# EAGLE schematic Arduino car (EAGLE 9.6.2)
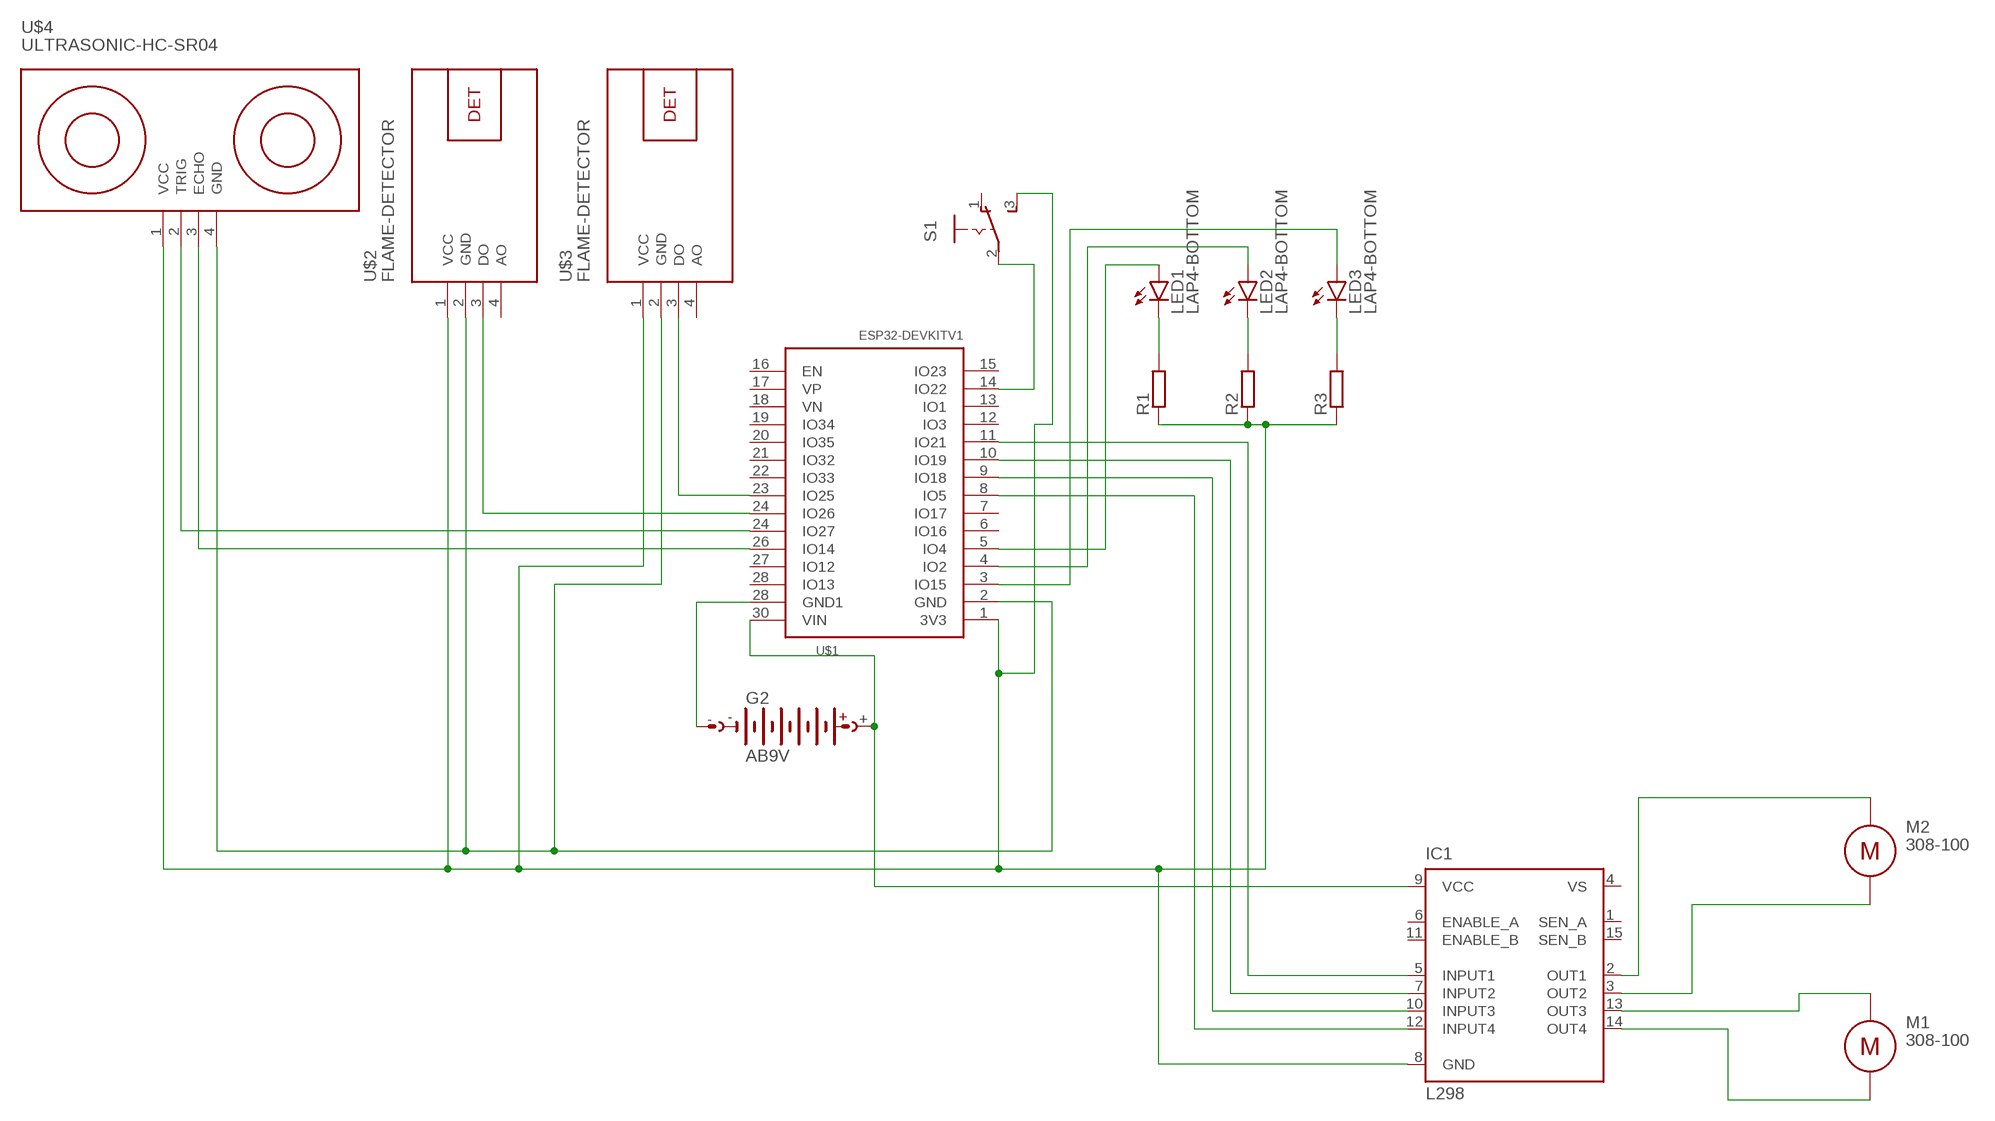
[diagram p0: schematic, sheet 1]

## Parts
G2  AB9V  [AB9V]
IC1  L298  [MULTIWATT-15]
LED1  LAP4-BOTTOM  [P47F-BOTTOM]
LED2  LAP4-BOTTOM  [P47F-BOTTOM]
LED3  LAP4-BOTTOM  [P47F-BOTTOM]
M1  308-100  [308-100]
M2  308-100  [308-100]
R1  BVS  [BVS]
R2  BVS  [BVS]
R3  BVS  [BVS]
S1  255SB  [255SB]
U$1  ESP32DEVKITV1  [ESP32-DEVKITV1]
U$2  FLAME-DETECTOR  [FLAME-DETECTOR]
U$3  FLAME-DETECTOR  [FLAME-DETECTOR]
U$4  ULTRASONIC-HC-SR04  [ULTRASONIC-HC-SR04]

## Nets
N$1: G2.+ IC1.9(VCC) U$1.30(VIN)
N$2: G2.- U$1.28(GND1)
N$3: IC1.8(GND) R1.2 R2.2 R3.2 S1.3(S) U$1.1(3V3) U$2.1(VCC) U$3.1(VCC) U$4.1(VCC)
N$4: U$1.2(GND) U$2.2(GND) U$3.2(GND) U$4.4(GND)
N$5: U$1.24(IO27) U$4.2(TRIG)
N$6: U$1.26(IO14) U$4.3(ECHO)
N$7: LED1.C R1.1
N$8: LED2.C R2.1
N$9: LED3.C R3.1
N$10: IC1.2(OUT1) M2.POS
N$11: IC1.3(OUT2) M2.NEG
N$12: IC1.13(OUT3) M1.POS
N$13: IC1.14(OUT4) M1.NEG
N$14: IC1.5(INPUT1) U$1.11(IO21)
N$15: U$1.24(IO26) U$2.3(DO)
N$16: U$1.23(IO25) U$3.3(DO)
N$17: IC1.7(INPUT2) U$1.10(IO19)
N$18: IC1.10(INPUT3) U$1.9(IO18)
N$19: IC1.12(INPUT4) U$1.8(IO5)
N$20: LED1.A U$1.5(IO4)
N$21: LED2.A U$1.4(IO2)
N$22: LED3.A U$1.3(IO15)
N$23: S1.2(P) U$1.14(IO22)
Unconnected: IC1.1(SEN_A) IC1.6(ENABLE_A) IC1.11(ENABLE_B) IC1.15(SEN_B) S1.1(O) U$1.6(IO16) U$1.7(IO17) U$1.12(IO3) U$1.13(IO1) U$1.15(IO23) U$1.16(EN) U$1.17(VP) U$1.18(VN) U$1.19(IO34) U$1.20(IO35) U$1.21(IO32) U$1.22(IO33) U$1.27(IO12) U$1.28(IO13) U$2.4(AO) U$3.4(AO)

## Power pins joined to a net without a drawn wire
VS: IC1.4(VS)

## Library data of the parts
G2 = battery:AB9V: 9-V BATTERY CLIP
IC1 = st-microelectronics-2:L298: DUAL FULL-BRIDGE DRIVER
LED1-LED3 = led:*P4: PointLED® Enhanced Thinfilm LED TOP & BOTTOM mount LS P47F, LR P47F, LA P47F, LY P47F, LT P4SG, LB P4SG, LW P4SG Source: http://catalog.osram-os.com .. LA_LR_LS_LY_P47F_Pb_free.pdf
M1 M2 = motor:308-100: Pico Vibe 8mm Vibration Motor - 3mm Type; PRECISION_MICRODRIVES: 308-100
R1-R3 = resistor-shunt:BVS: SMD SHUNT RESISTOR; OC_FARNELL: unknown; OC_NEWARK: unknown
S1 = switch:255SB: SLIDING SWITCH Distributor Buerklin, 11G810
U$1 = ESP32-DEVKITV1:ESP32DEVKITV1
U$2 U$3 = diy-modules:FLAME-DETECTOR: Flame Detector Click here to find device on ebay.com <http://www.ebay.com/sch/flame+detector+arduino>
U$4 = diy-modules:ULTRASONIC-HC-SR04: Ultrasonic Ranging Module HC-SR04 More details available here: http://randomnerdtutorials.com/complete-guide-for-ultrasonic-sensor-hc-sr04/ Click here to find device on ebay.com <http://www.ebay.com/sch/hc+sr04+ultrasonic>